# Altium schematic sheet STM32.SchDoc
size A2
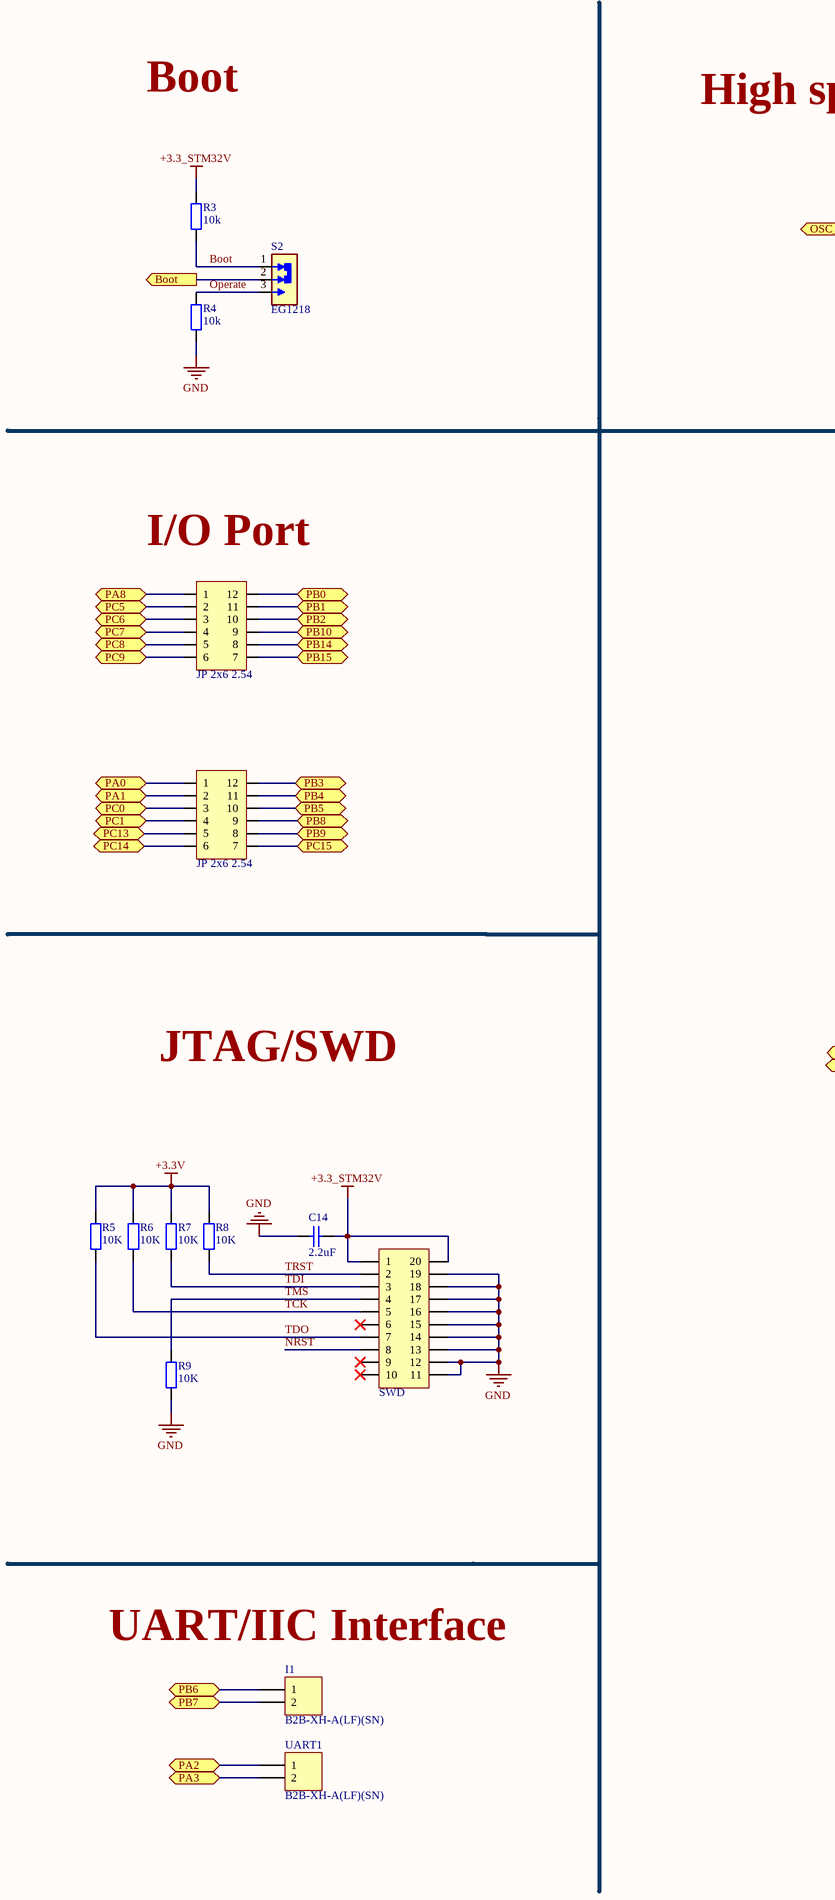
[diagram p0: STM32.SchDoc, left]
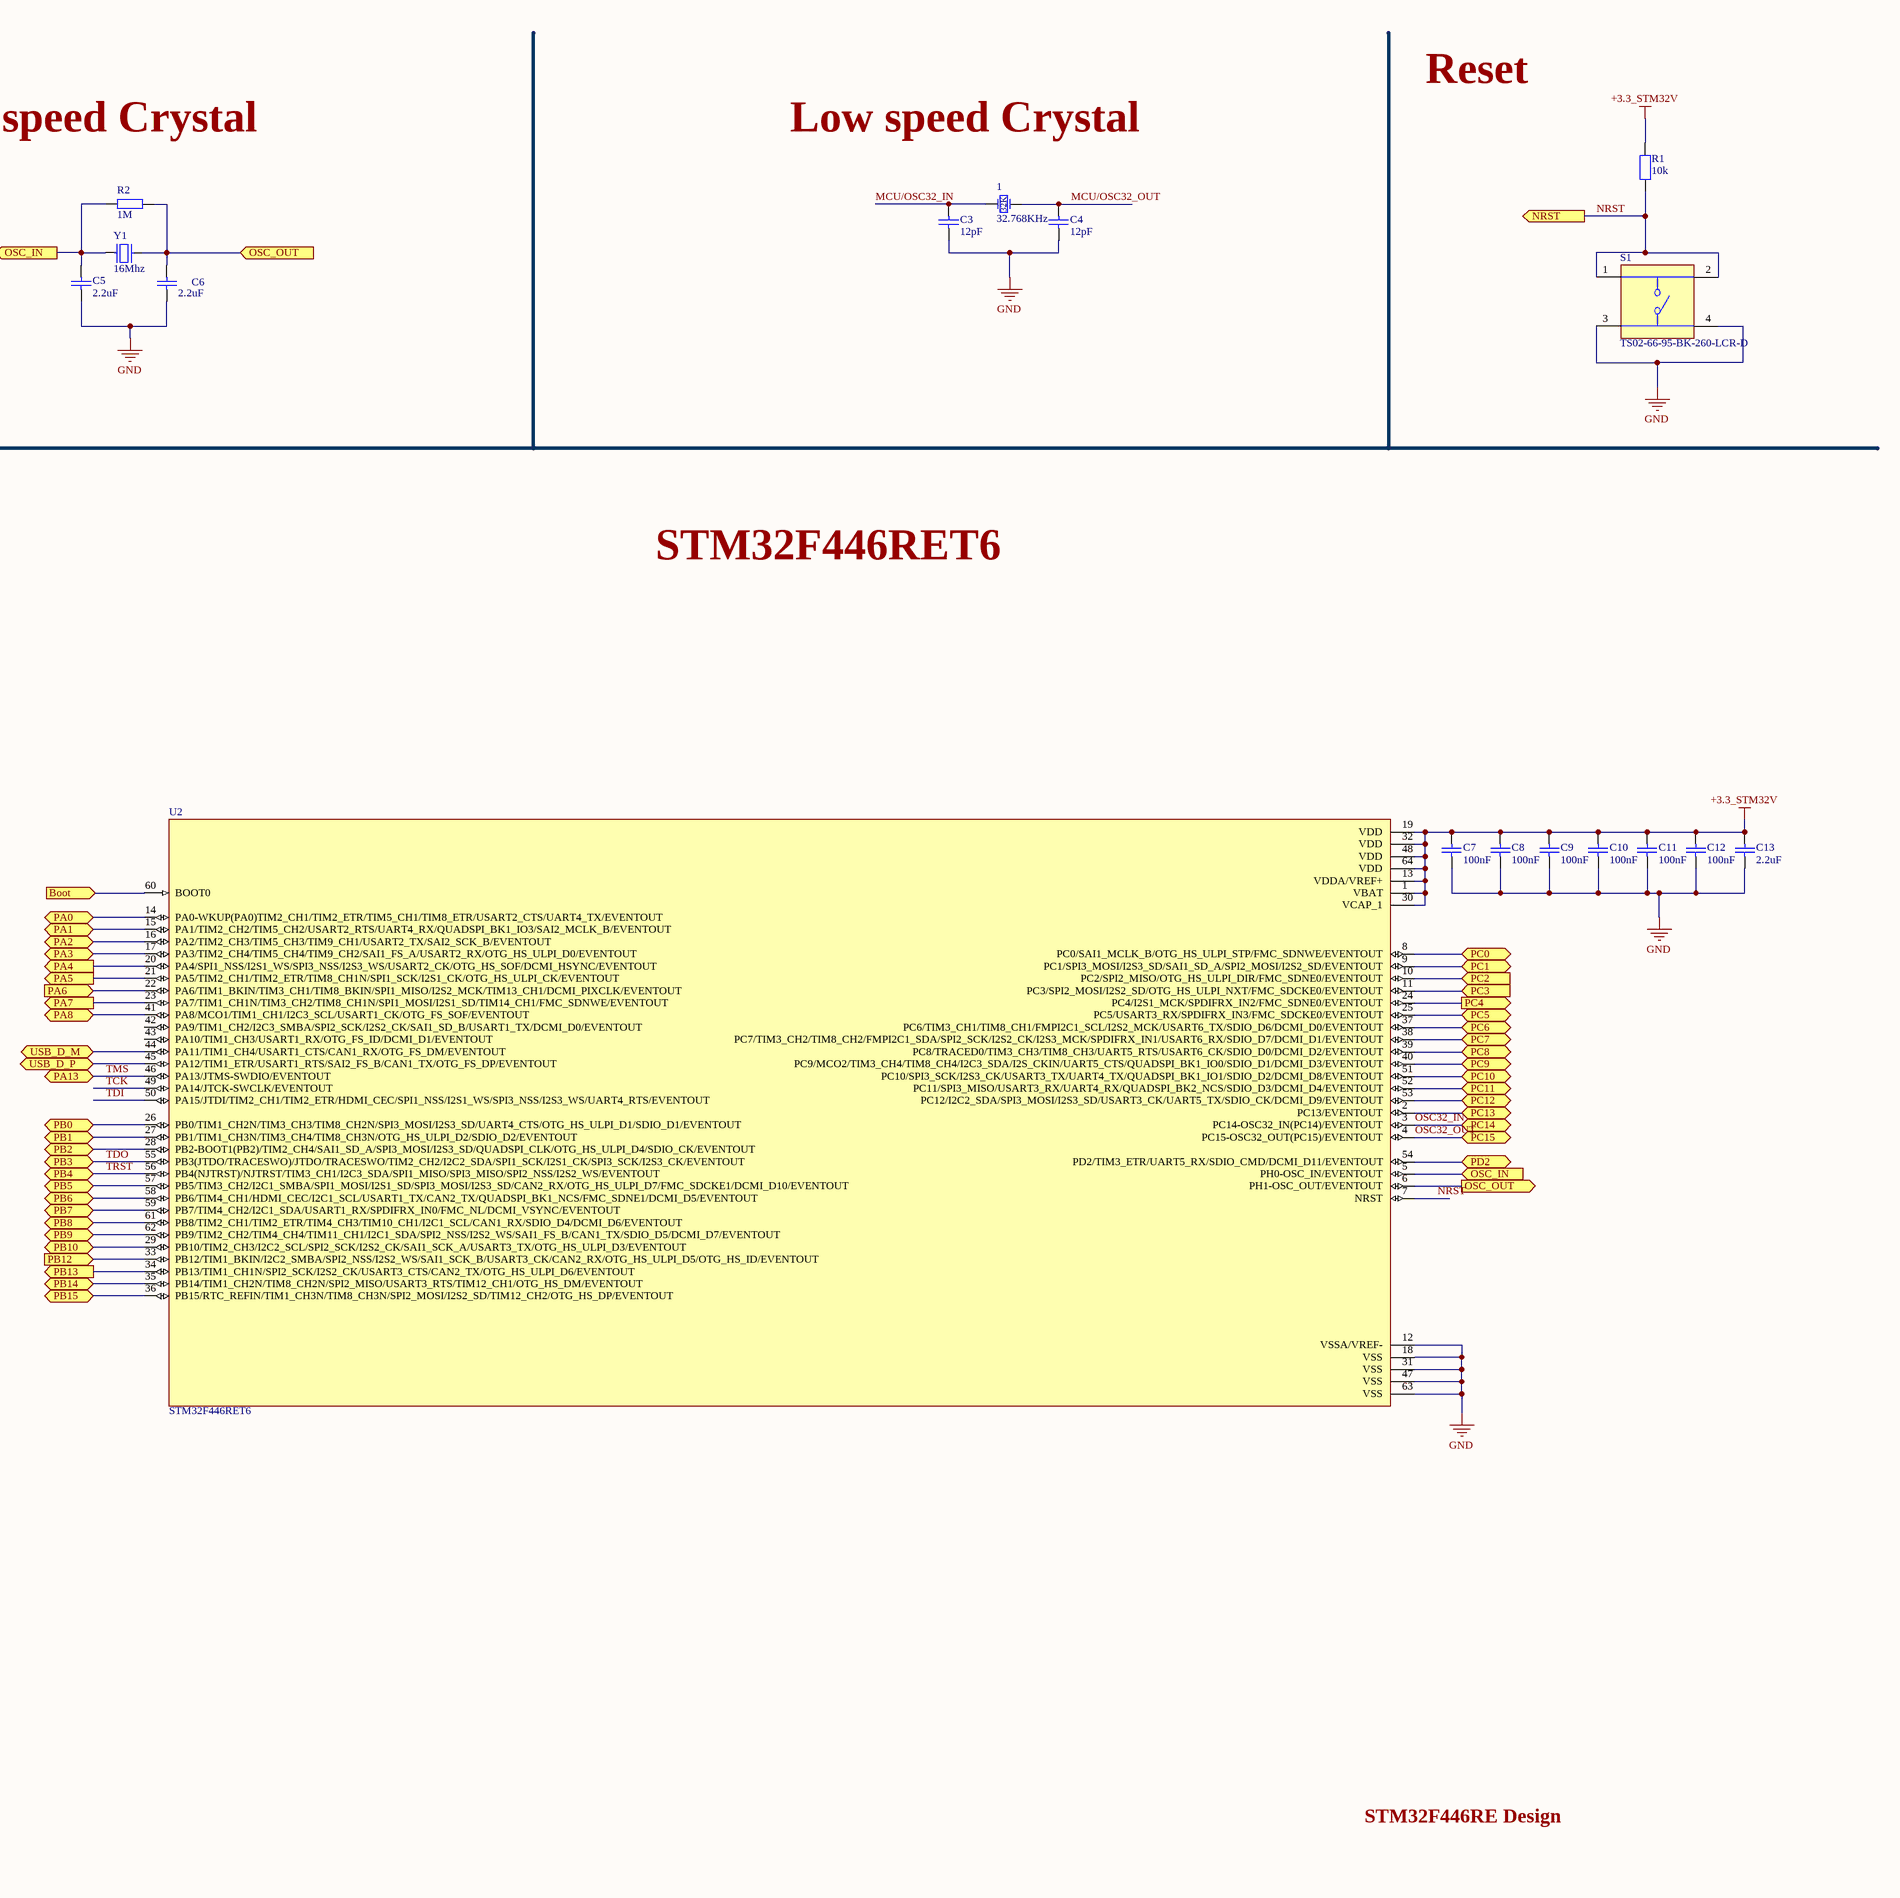
[diagram p1: STM32.SchDoc, right]

## Parts
1  32.768KHz  [Crystal_ABS07_SMD-3.2x1.5MM]
C3  12pF  [tu 0805]
C4  12pF  [tu 0805]
C5  2.2uF  [tu 0805]
C6  2.2uF  [tu 0805]
C7  100nF  [tu 0805]
C8  100nF  [tu 0805]
C9  100nF  [tu 0805]
C10  100nF  [tu 0805]
C11  100nF  [tu 0805]
C12  100nF  [tu 0805]
C13  2.2uF  [tu 0805]
C14  2.2uF  [tu 0805]
I1  B2B-XH-A(LF)(SN)  [CON2_100_B2B-XH-A_TH_ST]
JP1  JP 2x6 2.54  [JP 2x6 DT]
JP2  JP 2x6 2.54  [JP 2x6 DT]
JTAG/SWD1  SWD  [JP 2x10 DT]
R1  10k  [tro smd 0805]
R2  1M  [tro smd 0805]
R3  10k  [tro smd 0805]
R4  10k  [tro smd 0805]
R5  10K  [tro smd 0805]
R6  10K  [tro smd 0805]
R7  10K  [tro smd 0805]
R8  10K  [tro smd 0805]
R9  10K  [tro smd 0805]
S1  TS02-66-95-BK-260-LCR-D  [SW_TS02-66-95-BK-260-LCR-D]
S2  EG1218  [SW_EG1218]
U2  STM32F446RET6  [QFP50P1200X1200X160-64N]
UART1  B2B-XH-A(LF)(SN)  [CON2_100_B2B-XH-A_TH_ST]
Y1  16Mhz  [Thach Anh 2 chan cam]

## Ports
Boot (in), Boot (out), NRST (out), OSC_IN (in), OSC_IN (out), OSC_OUT (in), OSC_OUT (out), PA0 (bidir), PA1 (bidir), PA2 (bidir), PA3 (bidir), PA4 (out), PA5 (out), PA6 (in), PA7 (out), PA8 (bidir), PA13 (bidir), PB0 (bidir), PB1 (bidir), PB2 (bidir), PB3 (bidir), PB4 (bidir), PB5 (bidir), PB6 (bidir), PB7 (bidir), PB8 (bidir), PB9 (bidir), PB10 (bidir), PB12 (in), PB13 (out), PB14 (bidir), PB15 (bidir), PC0 (bidir), PC1 (bidir), PC2 (in), PC3 (in), PC4 (out), PC5 (bidir), PC6 (bidir), PC7 (bidir), PC8 (bidir), PC9 (bidir), PC10 (bidir), PC11 (bidir), PC12 (bidir), PC13 (bidir), PC14 (bidir), PC15 (bidir), PD2 (bidir), USB_D_M (bidir), USB_D_P (bidir)

## Nets
+3.3_STM32V: C7.1 C8.1 C9.1 C10.1 C11.1 C12.1 C13.1 C14.2 JTAG/SWD1.1 JTAG/SWD1.20 R1.1 R3.1 U2.1(VBAT) U2.13(VDDA/VREF+) U2.19(VDD) U2.30(VCAP_1) U2.32(VDD) U2.48(VDD) U2.64(VDD)
+3.3V: R5.2 R6.2 R7.2 R8.2
GND: C3.2 C4.2 C5.2 C6.2 C7.2 C8.2 C9.2 C10.2 C11.2 C12.2 C13.2 C14.1 JTAG/SWD1.11 JTAG/SWD1.12 JTAG/SWD1.13 JTAG/SWD1.14 JTAG/SWD1.15 JTAG/SWD1.16 JTAG/SWD1.17 JTAG/SWD1.18 JTAG/SWD1.19 R4.2 R9.1 S1.3 S1.4 U2.12(VSSA/VREF-) U2.18(VSS) U2.31(VSS) U2.47(VSS) U2.63(VSS)
Boot: S2.2(COM) U2.60(BOOT0) ; port Boot
Boot: R3.2 S2.1(NC)  [a separate net that carries the same name]
MCU/OSC32_IN: 1.1(OSC1) C3.1
MCU/OSC32_OUT: 1.2(OSC2) C4.1
NRST: JTAG/SWD1.8 R1.2 S1.1 S1.2 U2.7(NRST) ; port NRST
Operate: R4.1 S2.3(NO)
OSC32_IN: JP2.6 U2.3(PC14-OSC32_IN(PC14)/EVENTOUT) ; port PC14
OSC32_OUT: JP2.7 U2.4(PC15-OSC32_OUT(PC15)/EVENTOUT) ; port PC15
OSC_IN: C5.1 R2.1 U2.5(PH0-OSC_IN/EVENTOUT) Y1.1 ; port OSC_IN
OSC_OUT: C6.1 R2.2 U2.6(PH1-OSC_OUT/EVENTOUT) Y1.2 ; port OSC_OUT
PA0: JP2.1 U2.14(PA0-WKUP(PA0)TIM2_CH1/TIM2_ETR/TIM5_CH1/TIM8_ETR/USART2_CTS/UART4_TX/EVENTOUT) ; port PA0
PA1: JP2.2 U2.15(PA1/TIM2_CH2/TIM5_CH2/USART2_RTS/UART4_RX/QUADSPI_BK1_IO3/SAI2_MCLK_B/EVENTOUT) ; port PA1
PA2: U2.16(PA2/TIM2_CH3/TIM5_CH3/TIM9_CH1/USART2_TX/SAI2_SCK_B/EVENTOUT) UART1.1 ; port PA2
PA3: U2.17(PA3/TIM2_CH4/TIM5_CH4/TIM9_CH2/SAI1_FS_A/USART2_RX/OTG_HS_ULPI_D0/EVENTOUT) UART1.2 ; port PA3
PA4: U2.20(PA4/SPI1_NSS/I2S1_WS/SPI3_NSS/I2S3_WS/USART2_CK/OTG_HS_SOF/DCMI_HSYNC/EVENTOUT) ; port PA4
PA5: U2.21(PA5/TIM2_CH1/TIM2_ETR/TIM8_CH1N/SPI1_SCK/I2S1_CK/OTG_HS_ULPI_CK/EVENTOUT) ; port PA5
PA6: U2.22(PA6/TIM1_BKIN/TIM3_CH1/TIM8_BKIN/SPI1_MISO/I2S2_MCK/TIM13_CH1/DCMI_PIXCLK/EVENTOUT) ; port PA6
PA7: U2.23(PA7/TIM1_CH1N/TIM3_CH2/TIM8_CH1N/SPI1_MOSI/I2S1_SD/TIM14_CH1/FMC_SDNWE/EVENTOUT) ; port PA7
PA8: JP1.1 U2.41(PA8/MCO1/TIM1_CH1/I2C3_SCL/USART1_CK/OTG_FS_SOF/EVENTOUT) ; port PA8
PB0: JP1.12 U2.26(PB0/TIM1_CH2N/TIM3_CH3/TIM8_CH2N/SPI3_MOSI/I2S3_SD/UART4_CTS/OTG_HS_ULPI_D1/SDIO_D1/EVENTOUT) ; port PB0
PB1: JP1.11 U2.27(PB1/TIM1_CH3N/TIM3_CH4/TIM8_CH3N/OTG_HS_ULPI_D2/SDIO_D2/EVENTOUT) ; port PB1
PB2: JP1.10 U2.28(PB2-BOOT1(PB2)/TIM2_CH4/SAI1_SD_A/SPI3_MOSI/I2S3_SD/QUADSPI_CLK/OTG_HS_ULPI_D4/SDIO_CK/EVENTOUT) ; port PB2
PB5: JP2.10 U2.57(PB5/TIM3_CH2/I2C1_SMBA/SPI1_MOSI/I2S1_SD/SPI3_MOSI/I2S3_SD/CAN2_RX/OTG_HS_ULPI_D7/FMC_SDCKE1/DCMI_D10/EVENTOUT) ; port PB5
PB6: I1.1 U2.58(PB6/TIM4_CH1/HDMI_CEC/I2C1_SCL/USART1_TX/CAN2_TX/QUADSPI_BK1_NCS/FMC_SDNE1/DCMI_D5/EVENTOUT) ; port PB6
PB7: I1.2 U2.59(PB7/TIM4_CH2/I2C1_SDA/USART1_RX/SPDIFRX_IN0/FMC_NL/DCMI_VSYNC/EVENTOUT) ; port PB7
PB8: JP2.9 U2.61(PB8/TIM2_CH1/TIM2_ETR/TIM4_CH3/TIM10_CH1/I2C1_SCL/CAN1_RX/SDIO_D4/DCMI_D6/EVENTOUT) ; port PB8
PB9: JP2.8 U2.62(PB9/TIM2_CH2/TIM4_CH4/TIM11_CH1/I2C1_SDA/SPI2_NSS/I2S2_WS/SAI1_FS_B/CAN1_TX/SDIO_D5/DCMI_D7/EVENTOUT) ; port PB9
PB10: JP1.9 U2.29(PB10/TIM2_CH3/I2C2_SCL/SPI2_SCK/I2S2_CK/SAI1_SCK_A/USART3_TX/OTG_HS_ULPI_D3/EVENTOUT) ; port PB10
PB12: U2.33(PB12/TIM1_BKIN/I2C2_SMBA/SPI2_NSS/I2S2_WS/SAI1_SCK_B/USART3_CK/CAN2_RX/OTG_HS_ULPI_D5/OTG_HS_ID/EVENTOUT) ; port PB12
PB13: U2.34(PB13/TIM1_CH1N/SPI2_SCK/I2S2_CK/USART3_CTS/CAN2_TX/OTG_HS_ULPI_D6/EVENTOUT) ; port PB13
PB14: JP1.8 U2.35(PB14/TIM1_CH2N/TIM8_CH2N/SPI2_MISO/USART3_RTS/TIM12_CH1/OTG_HS_DM/EVENTOUT) ; port PB14
PB15: JP1.7 U2.36(PB15/RTC_REFIN/TIM1_CH3N/TIM8_CH3N/SPI2_MOSI/I2S2_SD/TIM12_CH2/OTG_HS_DP/EVENTOUT) ; port PB15
PC0: JP2.3 U2.8(PC0/SAI1_MCLK_B/OTG_HS_ULPI_STP/FMC_SDNWE/EVENTOUT) ; port PC0
PC1: JP2.4 U2.9(PC1/SPI3_MOSI/I2S3_SD/SAI1_SD_A/SPI2_MOSI/I2S2_SD/EVENTOUT) ; port PC1
PC2: U2.10(PC2/SPI2_MISO/OTG_HS_ULPI_DIR/FMC_SDNE0/EVENTOUT) ; port PC2
PC3: U2.11(PC3/SPI2_MOSI/I2S2_SD/OTG_HS_ULPI_NXT/FMC_SDCKE0/EVENTOUT) ; port PC3
PC4: U2.24(PC4/I2S1_MCK/SPDIFRX_IN2/FMC_SDNE0/EVENTOUT) ; port PC4
PC5: JP1.2 U2.25(PC5/USART3_RX/SPDIFRX_IN3/FMC_SDCKE0/EVENTOUT) ; port PC5
PC6: JP1.3 U2.37(PC6/TIM3_CH1/TIM8_CH1/FMPI2C1_SCL/I2S2_MCK/USART6_TX/SDIO_D6/DCMI_D0/EVENTOUT) ; port PC6
PC7: JP1.4 U2.38(PC7/TIM3_CH2/TIM8_CH2/FMPI2C1_SDA/SPI2_SCK/I2S2_CK/I2S3_MCK/SPDIFRX_IN1/USART6_RX/SDIO_D7/DCMI_D1/EVENTOUT) ; port PC7
PC8: JP1.5 U2.39(PC8/TRACED0/TIM3_CH3/TIM8_CH3/UART5_RTS/USART6_CK/SDIO_D0/DCMI_D2/EVENTOUT) ; port PC8
PC9: JP1.6 U2.40(PC9/MCO2/TIM3_CH4/TIM8_CH4/I2C3_SDA/I2S_CKIN/UART5_CTS/QUADSPI_BK1_IO0/SDIO_D1/DCMI_D3/EVENTOUT) ; port PC9
PC10: U2.51(PC10/SPI3_SCK/I2S3_CK/USART3_TX/UART4_TX/QUADSPI_BK1_IO1/SDIO_D2/DCMI_D8/EVENTOUT) ; port PC10
PC11: U2.52(PC11/SPI3_MISO/USART3_RX/UART4_RX/QUADSPI_BK2_NCS/SDIO_D3/DCMI_D4/EVENTOUT) ; port PC11
PC12: U2.53(PC12/I2C2_SDA/SPI3_MOSI/I2S3_SD/USART3_CK/UART5_TX/SDIO_CK/DCMI_D9/EVENTOUT) ; port PC12
PC13: JP2.5 U2.2(PC13/EVENTOUT) ; port PC13
PD2: U2.54(PD2/TIM3_ETR/UART5_RX/SDIO_CMD/DCMI_D11/EVENTOUT) ; port PD2
TCK: JTAG/SWD1.5 R6.1 U2.49(PA14/JTCK-SWCLK/EVENTOUT)
TDI: JTAG/SWD1.3 R7.1 U2.50(PA15/JTDI/TIM2_CH1/TIM2_ETR/HDMI_CEC/SPI1_NSS/I2S1_WS/SPI3_NSS/I2S3_WS/UART4_RTS/EVENTOUT)
TDO: JP2.12 JTAG/SWD1.7 R5.1 U2.55(PB3(JTDO/TRACESWO)/JTDO/TRACESWO/TIM2_CH2/I2C2_SDA/SPI1_SCK/I2S1_CK/SPI3_SCK/I2S3_CK/EVENTOUT) ; port PB3
TMS: JTAG/SWD1.4 R9.2 U2.46(PA13/JTMS-SWDIO/EVENTOUT) ; port PA13
TRST: JP2.11 JTAG/SWD1.2 R8.1 U2.56(PB4(NJTRST)/NJTRST/TIM3_CH1/I2C3_SDA/SPI1_MISO/SPI3_MISO/SPI2_NSS/I2S2_WS/EVENTOUT) ; port PB4
USB_D_M: U2.44(PA11/TIM1_CH4/USART1_CTS/CAN1_RX/OTG_FS_DM/EVENTOUT) ; port USB_D_M
USB_D_P: U2.45(PA12/TIM1_ETR/USART1_RTS/SAI2_FS_B/CAN1_TX/OTG_FS_DP/EVENTOUT) ; port USB_D_P

Not connected (* = marked no-connect by the designer): JTAG/SWD1 6* 9* 10*; U2 42(PA9/TIM1_CH2/I2C3_SMBA/SPI2_SCK/I2S2_CK/SAI1_SD_B/USART1_TX/DCMI_D0/EVENTOUT) 43(PA10/TIM1_CH3/USART1_RX/OTG_FS_ID/DCMI_D1/EVENTOUT)

## Notes on the sheet
- Reset
- Boot
- High speed Crystal
- Low speed Crystal
- (near JP1) I/O Port
- STM32F446RET6
- JTAG/SWD
- (near I1) UART/IIC Interface
- STM32F446RE Design
- Title
- Size:
- Date:
- File:
- A2
- Number:
- Time:
- Revision:
- Sheet
- of
- (in symbol ABS07-32.768KHZ-T) 32K

## Library data of the parts
1 = ABS07-32.768KHZ-T: CRYSTAL 32.7680KHZ 12.5pF SMD; Solder: SMT; CompanyID: VT-01153; MPN: ABS07-32.768KHZ-T; Value: 32.768KHz; Category: CRYSTAL
C3-C14 = Tu 0805 10pF 50V 10%: Dán; Don_Vi: Con; So_Chan: 2; Ten_Linh_Kien: Tụ 0805 10P 10% 50V; Ma_Hang: MH004554; Chung_Loai: Dán; Kieu_Chan: *
I1 UART1 = CON-PLG_2X1-100-ST-TH: 2 Pins, 1 Row 2.54mm Pitch, Straight Connector, male; Manufacturer: JST; Mating Part Number: XHP-2; Crimp Part Number: ASXHSXH22K51; Alternate Part Number-1: NA; Manufacturer Part Number: B2B-XH-A(LF)(SN); Case/Package: TH-CON; Supplier-1: SP ROAD; Supplier Part Number-1: B2B-XH-A(LF)(SN)
JP1 JP2 = JP 2x6 2.54 Duc Thang: Cắm; Ten_Linh_Kien: Jump Đôi Đực 2.54MM 2x40P Thẳng 11MM; Don_Vi: Con; Ma_Hang: MH002686; Ghi_Chu: *; Kieu_Chan: *; Chung_Loai: Cắm
JTAG/SWD1 = JP 2x10 2.54 Duc Thang: Cắm; Ten_Linh_Kien: Jump Đôi Đực 2.54MM 2x40P Thẳng 11MM; Don_Vi: Con; Ma_Hang: MH002686; Ghi_Chu: *; Kieu_Chan: *; Chung_Loai: Cắm
R1-R4 = Tro 0805 1% 1k: Dán; Don_Vi: Con; So_Chan: 2; Ten_Linh_Kien: Trở 0805 1% 1k; Ma_Hang: MH005468; Chung_Loai: Dán; Kieu_Chan: *
R5-R9 = Tro 0805 1% 10k: Dán; Don_Vi: Con; So_Chan: 2; Ten_Linh_Kien: Trở 0805 1% 10k; Ma_Hang: MH005473; Chung_Loai: Dán; Kieu_Chan: *
S1 = TS02-66-95-BK-260-LCR-D: MF: {'manufacturer': u'CUI Devices'}; Package: None; Price: None; Value: *; MP: TS02-66-95-BK-260-LCR-D; Availability: Unavailable
S2 = EG1218: Slide Switch, EG Series, SPDT, Non-Shorting, ON-ON, 200mA DC, 30VDC, PC Pin | E-Switch EG1218; SnapEDA_Link: https://www.snapeda.com/parts/EG1218/E-Switch/view-part/?ref=snap; Package: None; Value: *; MF: E-Switch; MP: EG1218; Check_prices: https://www.snapeda.com/parts/EG1218/E-Switch/view-part/?ref=eda
U2 = STM32F446RET6: MCU 32-Bit STM32 ARM Cortex M4 RISC 512KB Flash 2.5V/3.3V 64-Pin LQFP Tray; MF: {'manufacturer': u'STMicroelectronics'}; Package: None; Price: None; Value: *; MP: STM32F446RET6; Availability: Unavailable
Y1 = Thach Anh 2 chan Cam: Crystal For all Crystal 2pin.; Value: 4Mhz